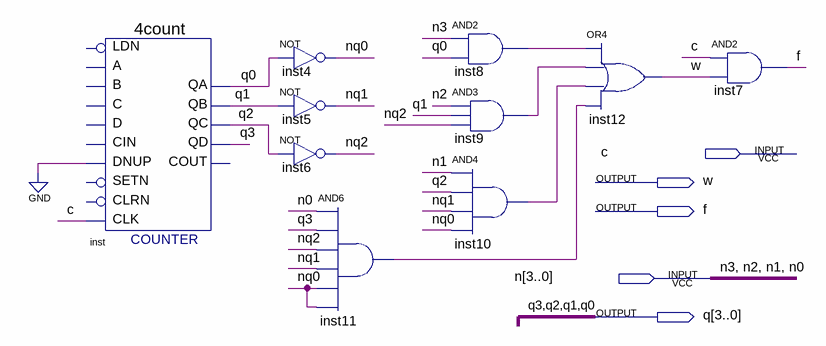
[diagram p0: schematic sheet]
// Quartus schematic s83_du.bdf as structural Verilog: 10 symbols, 5 pins
module s83_du (
  input  c,
  input  [3:0] n,
  output w,
  output f,
  output [3:0] q
);

  wire inst8_out, inst9_out, inst10_out, inst11_out, nq0, nq1, nq2;

  \4count  inst (
    .DNUP(1'b0), .CLK(c), .QA(q[0]), .QB(q[1]), .QC(q[2]), .QD(q[3]));  // open: LDN, B, A, D, CIN, SETN, C, CLRN, COUT
  not inst4 (nq0, q[0]);
  not inst5 (nq1, q[1]);
  not inst6 (nq2, q[2]);
  and inst11 (inst11_out, n[0], q[3], nq2, nq1, nq0, nq0);
  and inst8 (inst8_out, n[3], q[0]);
  and inst9 (inst9_out, n[2], q[1], nq2);
  and inst10 (inst10_out, n[1], q[2], nq1, nq0);
  or inst12 (w, inst8_out, inst9_out, inst10_out, inst11_out);
  and inst7 (f, c, w);
endmodule
